# EAGLE design 255sb to smd switch (EAGLE 9.4.0)
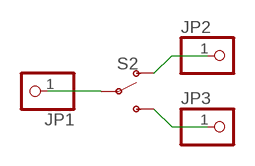
[diagram p0: schematic, sheet 1]

## Parts
JP1  PINHD-1X01_2.54-SMD-90°  [1X01SMD/90]
JP2  PINHD-1X01_2.54-SMD-90°  [1X01SMD/90]
JP3  PINHD-1X01_2.54-SMD-90°  [1X01SMD/90]
S2  SWITCH-SPDT-SMD-RIGHT-ANGLE  [SWITCH_SPST_SMD_A]

## Nets
N$1: JP2.1 S2.1(O)
N$2: JP3.1 S2.3(S)
N$3: JP1.1 S2.2(P)

## Library data of the parts
JP1-JP3 = pinhead-2:PINHD-1X01: PIN HEADER
S2 = SparkFun-Switches:SWITCH-SPDT: Single Pole, Double Throw (SPDT) Switch Single-pole, double-throw (SPDT) switch. Variant Overview SMD-AYZ0202 Surface Mount DPDT Switch <https://www.sparkfun.com/products/597> (COM-00597) Used on e.g. LilyPad Arduino USB - ATmega32U4 Board <https://www.sparkfun.com/products/12049> PTH-11.6X4.0MM SPDT Mini Power Switch <https://www.sparkfun.com/products/102> (COM-00102) Used on e.g. SparkFun Simon Says - Through-Hole Soldering Kit <https://www.sparkfun.com/products/10547> (KIT-10547) PTH-11.6X4.0MM-KIT KIT version of SPDT Mini Power Switch - Simplifies soldering by removing tStop of switch pins - only one side can be soldered. PTH-11.6X4.0MM-LOCK LOCK version of SPDT Mini Power Switch - Offset pins hold switch in place for easier soldering. SMD-RIGHT-ANGLE Surface Mount Right Angle Switch <https://www.sparkfun.com/products/10860> (COM-10860) Used on e.g. SparkFun ESP8266 Thing <https://www.sparkfun.com/products/13231>; PROD_ID: SWCH-10651; SF_SKU: COM-10860

## Board
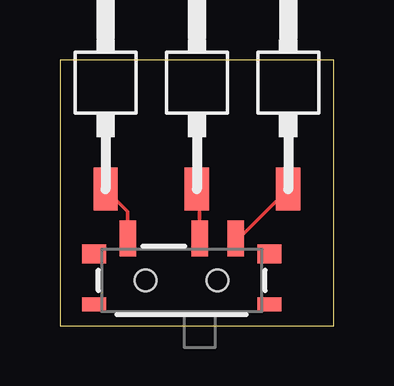
[diagram p1: board, top side]
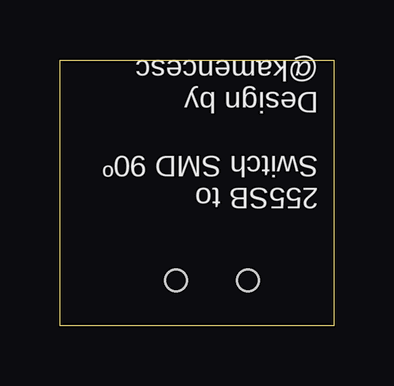
[diagram p2: board, bottom side, seen from below]

Size 11.42 x 11.1 mm. Coordinates in mm from the lower left corner, seen from the top.
Outline: 0,0 11.42,0 11.42,11.1 0,11.1 0,0
Copper layers (1*16): Top 0.035mm / dielectric 1.5mm / Bottom 0.035mm
Design rules "dirtypcbs_2_layer": minimum track width 5mil, minimum drill 12mil, track to track 5mil, track to pad 5mil, pad to pad 5mil, via to via 5mil, smd to smd 0mil, copper to edge 10mil, drill to drill 10mil, minimum pad ring 10mil, minimum via ring 6mil, stop-mask expansion 2mil, vias tented up to drill 25mil, thermal gap 10mil

### Footprints (pad centres in the part's own frame; a part is rotated, then mirrored left to right if it is on the bottom)
1X01SMD/90 = smd 1.016 x 1.778: 1 -1.27,-5.08
SWITCH_SPST_SMD_A = smd 0.7 x 1.5: 1 -2.25,-1.75; 2 -0.75,-1.75; 3 2.25,-1.75 | smd 1 x 0.6: GND1 -3.65,1; GND3 3.65,1 | smd 1 x 0.8: GND2 -3.65,-1.1; GND4 3.65,-1.1 | hole 0.9: -1.5,0; 1.5,0

### Placement (x,y rotation side)
JP1  6.99,10.79 0 top
JP2  10.79,10.79 0 top
JP3  3.17,10.79 0 top
S2  5.08,1.91 180 top

### Tracks (layer width: path | path; a pad name or v marks a point on that pad's centre or on a via)
N$1
  Top 0.152: JP2.1 7.46,3.65 S2.1
N$2
  Top 0.152: JP3.1 2.83,4.79 S2.3
N$3
  Top 0.152: JP1.1 5.83,5.6 S2.2

### Text on the board
bPlace: 255SB to / Switch SMD 90º / / Design by / @kamencesc